# Altium project 4-Port_USB_HUB_Project.PrjPcb
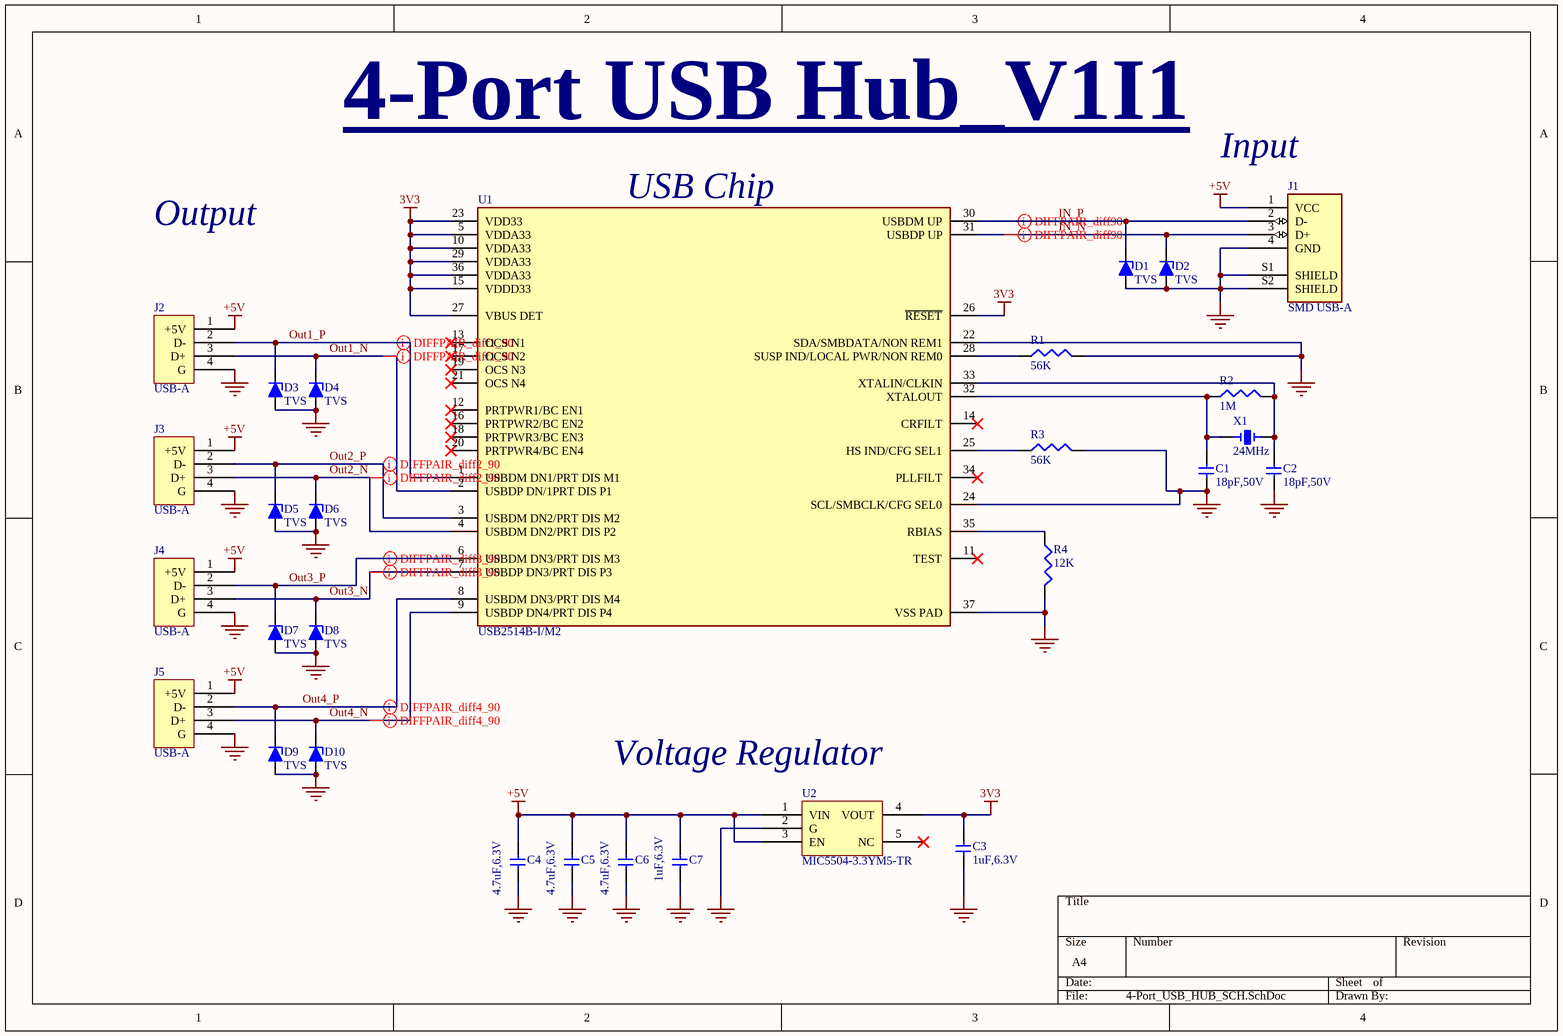
[diagram p0: 4-Port_USB_HUB_SCH.SchDoc]
CompanyName: Altium Training
1 sheet, 29 parts. Net scope: global (net labels, ports and power ports of the same name join across sheets).
Board file: 4-Port_USB_HUB_PCB.PcbDoc

## Sheet 4-Port_USB_HUB_SCH.SchDoc
size A4

### Parts
C1  18pF,50V  [18pF]
C2  18pF,50V  [18pF]
C3  1uF,6.3V  [1uF_CAP]
C4  4.7uF,6.3V  [4.7uF_CAP]
C5  4.7uF,6.3V  [4.7uF_CAP]
C6  4.7uF,6.3V  [4.7uF_CAP]
C7  1uF,6.3V  [1uF_CAP]
D1  TVS  [ESD Diode]
D2  TVS  [ESD Diode]
D3  TVS  [ESD Diode]
D4  TVS  [ESD Diode]
D5  TVS  [ESD Diode]
D6  TVS  [ESD Diode]
D7  TVS  [ESD Diode]
D8  TVS  [ESD Diode]
D9  TVS  [ESD Diode]
D10  TVS  [ESD Diode]
J1  SMD USB-A  [SMD USB-A]
J2  USB-A  [USB_Connector]
J3  USB-A  [USB_Connector]
J4  USB-A  [USB_Connector]
J5  USB-A  [USB_Connector]
R1  56K  [56K]
R2  1M  [1M Res]
R3  56K  [56K]
R4  12K  [1M Res]
U1  USB2514B-I/M2  [IC_microchip]
U2  MIC5504-3.3YM5-TR  [Voltage Regulator]
X1  24MHz  [Crystal]

### Nets
3V3: C3.1 U1.5(VDDA33) U1.10(VDDA33) U1.15(VDDD33) U1.23(VDD33) U1.26(~{RESET}) U1.27(VBUS_DET) U1.29(VDDA33) U1.36(VDDA33) U2.4(VOUT)
+5V: C4.1 C5.1 C6.1 C7.1 J1.1(VCC) J2.1(+5V) J3.1(+5V) J4.1(+5V) J5.1(+5V) U2.1(VIN) U2.3(EN)
GND: C1.2 C2.2 C3.2 C4.2 C5.2 C6.2 C7.2 D1.1 D2.1 D3.1 D4.1 D5.1 D6.1 D7.1 D8.1 D9.1 D10.1 J1.4(GND) J1.S1(SHIELD) J1.S2(SHIELD) J2.4(G) J3.4(G) J4.4(G) J5.4(G) R1.2 R3.2 R4.2 U1.22(SDA/SMBDATA/NON_REM1) U1.24(SCL/SMBCLK/CFG_SEL0) U1.37(VSS_PAD) U2.2(G)
IN_N: D2.2 J1.3(D+) U1.31(USBDP_UP)
IN_P: D1.2 J1.2(D-) U1.30(USBDM_UP)
Out1_N: D4.2 J2.3(D+) U1.2(USBDP_DN/1PRT_DIS_P1)
Out1_P: D3.2 J2.2(D-) U1.1(USBDM_DN1/PRT_DIS_M1)
Out2_N: D6.2 J3.3(D+) U1.4(USBDM_DN2/PRT_DIS_P2)
Out2_P: D5.2 J3.2(D-) U1.3(USBDM_DN2/PRT_DIS_M2)
Out3_N: D8.2 J4.3(D+) U1.7(USBDP_DN3/PRT_DIS_P3)
Out3_P: D7.2 J4.2(D-) U1.6(USBDM_DN3/PRT_DIS_M3)
Out4_N: D10.2 J5.3(D+) U1.9(USBDP_DN4/PRT_DIS_P4)
Out4_P: D9.2 J5.2(D-) U1.8(USBDM_DN3/PRT_DIS_M4)
NetC1_1: C1.1 R2.1 U1.32(XTALOUT) X1.1
NetC2_1: C2.1 R2.2 U1.33(XTALIN/CLKIN) X1.3
NetR1_1: R1.1 U1.28(SUSP_IND/LOCAL_PWR/NON_REM0)
NetR3_1: R3.1 U1.25(HS_IND/CFG_SEL1)
NetR4_1: R4.1 U1.35(RBIAS)

Not connected (* = marked no-connect by the designer): U1 11(TEST)* 12(PRTPWR1/BC_EN1)* 13(OCS_N1)* 14(CRFILT)* 16(PRTPWR2/BC_EN2)* 17(OCS_N2)* 18(PRTPWR3/BC_EN3)* 19(OCS_N3)* 20(PRTPWR4/BC_EN4)* 21(OCS_N4)* 34(PLLFILT)*; U2 5(NC)*

### Layout directives
differential pair; differential pair class diff90: IN_N, IN_P
differential pair; differential pair class diff1_90: Out1_N, Out1_P
differential pair; differential pair class diff2_90: Out2_N, Out2_P
differential pair; differential pair class diff3_90: Out3_N, Out3_P
differential pair; differential pair class diff4_90: Out4_N, Out4_P

### Notes on the sheet
- 4-Port USB Hub_V1I1
- (near J1) Input
- Output
- (near U1) USB Chip
- (near U2) Voltage Regulator

### Library data of the parts
C1 C2 = C0805C180J5GACTU: 18PF 50V 0805; Manufacturer: KEMET; Dielectric Material: Ceramic; Tolerance: 5%; Dielectric: C0G; Temperature Coefficient: 30ppm/°C; Dissipation Factor: 0.1%; Supplier 1: Digi-Key; Manufacturer Part Number: C0805C180J5GACTU; RoHS: Yes; Category: Ceramic Capacitors; Stock 1: 4285; Pricing 1: 1=0.13000, 10=0.09000, 50=0.05140, 100=0.04250, 500=0.02982, 1000=0.02468 (USD); Mount: Surface Mount,PCB; Case/Package: 0805; Number of Pins: 2; Contact Plating: Tin,Matte; Contact Material: Tin; Case Code (Imperial): 0805; Case Code (Metric): 2012; Min Operating Temperature: -55°C; Max Operating Temperature: 125°C; Capacitance: 18pF; Packaging: Tape and Reel; Voltage: 50V; Termination: SMD/SMT; Voltage Rating (DC): 50V; Package Quantity: 1; Voltage Rating: 50V; Series: C; Construction: Flat; Length: 2mm; Width: 1.2mm; Height: 0.78mm; Depth: 1.25mm; Lead Pitch: 0.75mm; Thickness: 0.035inch; Radiation Hardening: No; Lead Free: Lead Free; REACH SVHC: No SVHC; RoHS Compliant: Yes; ComponentLink1URL: https://datasheet.ciiva.com/22746/1769375-22746770.pdf?src-supplier=Element14; ComponentLink1Description: https://datasheet.ciiva.com/22746/1769375-22746770.pdf?src-supplier=Element14; ComponentLink2URL: https://datasheet.ciiva.com/26923/getdatasheetpartid-759702-26923980.pdf?src-supplier=Verical; ComponentLink2Description: https://datasheet.ciiva.com/26923/getdatasheetpartid-759702-26923980.pdf?src-supplier=Verical; ComponentLink3URL: https://datasheet.ciiva.com/26847/getdatasheetpartid-385668-26847862.pdf?src-supplier=Verical; ComponentLink3Description: https://datasheet.ciiva.com/26847/getdatasheetpartid-385668-26847862.pdf?src-supplier=Verical; Supplier Part Number 1: 399-1112-1-ND
C3 C7 = C0402C105K9PACTU: 1uF 6.3V 0402; Manufacturer: KEMET; Dielectric Material: Ceramic; Tolerance: 10%; Dielectric: X5R; Supplier 1: Digi-Key; Manufacturer Part Number: C0402C105K9PACTU; RoHS: Yes; Category: Ceramic Capacitors; Stock 1: 252140; Pricing 1: 1=0.10000, 10=0.02400, 50=0.01320, 100=0.01070, 500=0.00764, 1000=0.00601, 2500=0.00546, 5000=0.00503 (USD); Mount: Surface Mount; Case/Package: 0402; Number of Pins: 2; Case Code (Imperial): 0402; Min Operating Temperature: -55°C; Max Operating Temperature: 85°C; Capacitance: 1uF; Packaging: Tape and Reel; Voltage Rating: 6.3V; Voltage: 6.3V; Termination: SMD/SMT; Voltage Rating (DC): 6.3V; Package Quantity: 1; Series: C; Construction: Flat; Length: 1mm; Width: 0.02inch; Height: 0.5mm; Thickness: 0.022inch; Depth: 0.5mm; Lead Pitch: 0.3mm; Radiation Hardening: No; Lead Free: Lead Free; REACH SVHC: No SVHC; RoHS Compliant: Yes; ComponentLink1URL: https://datasheet.ciiva.com/28645/1789732-28645392.pdf?src-supplier=Element14; ComponentLink1Description: https://datasheet.ciiva.com/28645/1789732-28645392.pdf?src-supplier=Element14; ComponentLink2URL: https://datasheet.ciiva.com/7747/kem-c1006-x5r-smd-7747445.pdf?src-supplier=Element14; ComponentLink2Description: https://datasheet.ciiva.com/7747/kem-c1006-x5r-smd-7747445.pdf?src-supplier=Element14; ComponentLink3URL: https://datasheet.ciiva.com/7747/40889-7747623.pdf?src-supplier=Element14; ComponentLink3Description: https://datasheet.ciiva.com/7747/40889-7747623.pdf?src-supplier=Element14; ComponentLink4URL: https://datasheet.ciiva.com/18192/getdatasheetpartid-127800-18192427.pdf?src-supplier=Verical; ComponentLink4Description: https://datasheet.ciiva.com/18192/getdatasheetpartid-127800-18192427.pdf?src-supplier=Verical; Supplier Part Number 1: 399-4873-1-ND
C4-C6 = GRM155R60J475ME47D: 4.7uF 6.3V 0402; Manufacturer: Murata; Tolerance: 20%; Dielectric: X5R; Supplier 1: RSComponents; Manufacturer Part Number: GRM155R60J475ME47D; RoHS: Yes; Category: Ceramic Capacitors; Stock 1: 42550; Pricing 1: 50=0.07500, 500=0.02600, 2500=0.02500, 5000=0.02500, 10000=0.02300 (USD); Mount: Surface Mount; Case/Package: 0402; Case Code (Metric): 1005; Case Code (Imperial): 0402; Weight: 0.000212oz; Contact Plating: Tin; Min Operating Temperature: -55°C; Max Operating Temperature: 85°C; Package Quantity: 10000; Capacitance: 4.7uF; Voltage Rating: 6.3V; Packaging: Cut Tape; Termination: Standard; Voltage: 6.3V; Voltage Rating (DC): 6.3V; Series: GRM; Length: 1mm; Width: 0.5mm; Height: 0.5mm; Thickness: 0.022inch; Depth: 0.5mm; REACH SVHC: No SVHC; Lead Free: Lead Free; RoHS Compliant: Yes; ComponentLink1URL: https://datasheet.ciiva.com/6270/product-6270483.pdf?src-supplier=Digi-Key; ComponentLink1Description: https://datasheet.ciiva.com/6270/product-6270483.pdf?src-supplier=Digi-Key; ComponentLink2URL: https://datasheet.ciiva.com/6268/partnumbering-e-01-6268378.pdf?src-supplier=Digi-Key; ComponentLink2Description: https://datasheet.ciiva.com/6268/partnumbering-e-01-6268378.pdf?src-supplier=Digi-Key; ComponentLink3URL: https://datasheet.ciiva.com/46418/1769893-46418044.pdf?src-supplier=Element14; ComponentLink3Description: https://datasheet.ciiva.com/46418/1769893-46418044.pdf?src-supplier=Element14; ComponentLink4URL: https://datasheet.ciiva.com/46418/1769893-46418045.pdf?src-supplier=Element14; ComponentLink4Description: https://datasheet.ciiva.com/46418/1769893-46418045.pdf?src-supplier=Element14; ComponentLink5URL: https://datasheet.ciiva.com/6268/partnumbering-e-01-6268382.pdf?src-supplier=Digi-Key; ComponentLink5Description: https://datasheet.ciiva.com/6268/partnumbering-e-01-6268382.pdf?src-supplier=Digi-Key; Supplier Part Number 1: 8145230P
D1-D10 = ESD9B3.3ST5G: TVS Diode; Manufacturer: ON Semiconductor; Number of Bidirectional Channels: 1; Reverse Standoff Voltage: 3.3V; Min Breakdown Voltage: 5V; Clamping Voltage: 10.5V; Power Line Protection: No; Peak Pulse Current: 2A; Capacitance: 15pF; Direction: Bidirectional; Leakage Current: 1uA; Peak Pulse Power: 300mW; ESD Protection: Yes; Test Current: 1mA; Element Configuration: Single; Diode Type: ZENER; Supplier 1: Digi-Key; Manufacturer Part Number: ESD9B3.3ST5G; RoHS: Yes; Category: ESD and Circuit Protection ICs; Stock 1: 6111; Pricing 1: 1=0.23000, 10=0.18500, 100=0.09790, 500=0.06440, 1000=0.04379, 2000=0.03950 (USD); Case/Package: SOD-923-2; Number of Pins: 2; Contact Plating: Tin,Matte; Min Operating Temperature: -55°C; Max Operating Temperature: 150°C; Packaging: Tape and Reel; Resistor Type: Zener; Package Quantity: 1; Number of Elements: 1; Operating Supply Voltage: 3.3V; Reverse Breakdown Voltage: 5V; Breakdown Voltage: 5V; Number of Channels: 1; Polarity: Bidirectional; Termination: SMD/SMT; Working Voltage: 3.3V; Max Reverse Leakage Current: 1uA; Max Power Dissipation: 300mW; Number of Lines: 1; Series: Automotive, AEC-Q101; Length: 0.8mm; Width: 0.65mm; Height: 0.4mm; Depth: 0.6mm; Radiation Hardening: No; Lead Free: Lead Free; RoHS Compliant: Yes; REACH SVHC: No SVHC; Halogen Free: Halogen Free; ComponentLink1URL: https://datasheet.ciiva.com/339/esd9b-d-339712.pdf?src-supplier=Digi-Key; ComponentLink1Description: https://datasheet.ciiva.com/339/esd9b-d-339712.pdf?src-supplier=Digi-Key; ComponentLink2URL: https://datasheet.ciiva.com/339/esd9b-d-339712.pdf?src-supplier=Mouser; ComponentLink2Description: https://datasheet.ciiva.com/339/esd9b-d-339712.pdf?src-supplier=Mouser; ComponentLink3URL: https://datasheet.ciiva.com/25958/esd9b-d-25958117.pdf?src-supplier=Avnet+Europe; ComponentLink3Description: https://datasheet.ciiva.com/25958/esd9b-d-25958117.pdf?src-supplier=Avnet+Europe; ComponentLink4URL: https://datasheet.ciiva.com/339/esd9b-d-339713.pdf?src-supplier=Digi-Key; ComponentLink4Description: https://datasheet.ciiva.com/339/esd9b-d-339713.pdf?src-supplier=Digi-Key; ComponentLink5URL: https://datasheet.ciiva.com/339/esd9b-d-339714.pdf?src-supplier=Digi-Key; ComponentLink5Description: https://datasheet.ciiva.com/339/esd9b-d-339714.pdf?src-supplier=Digi-Key; ComponentLink6URL: https://datasheet.ciiva.com/22642/1596367-22642026.pdf?src-supplier=Element14; ComponentLink6Description: https://datasheet.ciiva.com/22642/1596367-22642026.pdf?src-supplier=Element14; ComponentLink7URL: https://datasheet.ciiva.com/26917/getdatasheetpartid-292713-26917946.pdf?src-supplier=Verical; ComponentLink7Description: https://datasheet.ciiva.com/26917/getdatasheetpartid-292713-26917946.pdf?src-supplier=Verical; ComponentLink8URL: https://datasheet.ciiva.com/22642/1596367-22642028.pdf?src-supplier=Element14; ComponentLink8Description: https://datasheet.ciiva.com/22642/1596367-22642028.pdf?src-supplier=Element14; ComponentLink9URL: https://datasheet.ciiva.com/11193/esd9b-d-11193999.pdf?src-supplier=Avnet; ComponentLink9Description: https://datasheet.ciiva.com/11193/esd9b-d-11193999.pdf?src-supplier=Avnet; Supplier Part Number 1: ESD9B3.3ST5GOSCT-ND
J1 = USB-A-S-S-B-SM2: USB - A USB 2.0 Receptacle Connector 4 Position Surface Mount, Right Angle, Horizontal; Manufacturer: Samtec; Number of Terminals/Pins: 4; Number of Ports: 1; Max Voltage Rating (AC): 30V; Supplier 1: Digi-Key; Manufacturer Part Number: USB-A-S-S-B-SM2; RoHS: Yes; Category: Connectors; Stock 1: 1137; Pricing 1: 1=2.03000, 10=1.84300, 25=1.73040, 40=1.65525, 80=1.58000, 230=1.42952, 440=1.31668, 945=1.12858, 2400=1.05335 (USD); Mount: Surface Mount,Horizontal; Contact Material: Bronze; Contact Plating: Gold; Housing Material: Thermoplastic; Min Operating Temperature: -50°C; Max Operating Temperature: 85°C; Packaging: Tray; Package Quantity: 1; Connector Type: USB; Number of Contacts: 4; Gender: Receptacle; Termination: Solder; Orientation: Right Angle; Series: USB-A; Length: 16.4mm; Depth: 14.8mm; Radiation Hardening: No; RoHS Compliant: Yes; ComponentLink1URL: https://datasheet.ciiva.com/851/usb-a-851788.pdf?src-supplier=Digi-Key; ComponentLink1Description: https://datasheet.ciiva.com/851/usb-a-851788.pdf?src-supplier=Digi-Key; Supplier Part Number 1: SAM10864-ND
J2-J5 = KUSBVX-AS1N-B30: Conn USB SKT 4 POS Solder ST Thru-Hole 4 Terminal 1 Port; Manufacturer: Kycon; Current Rating: 1A; Gender: Female; Connector Type: USB,Receptacle; Number of Contacts: 4; Insulation Resistance: 1GR; Number of Ports: 1; Supplier 1: Digi-Key; Manufacturer Part Number: KUSBVX-AS1N-B30; RoHS: Yes; Category: USB Connectors; Stock 1: 953; Pricing 1: 1=1.23000, 10=1.08400, 25=1.02040, 40=0.97800, 80=0.93550, 230=0.85043, 440=0.76539, 945=0.68034, 2400=0.61655 (USD); Mount: Through Hole; Color: Black; Contact Material: Bronze; Contact Plating: Gold; Housing Material: Thermoplastic; Insulation Color: Black; Termination: Solder; Orientation: Straight; Packaging: Tray; Number of Positions: 4; Package Quantity: 120; Series: KUSBVX; Radiation Hardening: No; Flammability Rating: UL94 V-0; RoHS Compliant: Yes; ComponentLink1URL: https://datasheet.ciiva.com/16668/kusbvx-as1n-xxx-16668448.pdf?src-supplier=Avnet+Europe; ComponentLink1Description: https://datasheet.ciiva.com/16668/kusbvx-as1n-xxx-16668448.pdf?src-supplier=Avnet+Europe; ComponentLink2URL: https://datasheet.ciiva.com/4599/kusbvx-334767-4599050.pdf?src-supplier=Mouser; ComponentLink2Description: https://datasheet.ciiva.com/4599/kusbvx-334767-4599050.pdf?src-supplier=Mouser; ComponentLink3URL: https://datasheet.ciiva.com/3095/kusbvx-as1n-xxx-3095637.pdf?src-supplier=Avnet; ComponentLink3Description: https://datasheet.ciiva.com/3095/kusbvx-as1n-xxx-3095637.pdf?src-supplier=Avnet; Supplier Part Number 1: 2092-KUSBVX-AS1N-B30-ND
R1 R3 = RC0402JR-0756KL: Manufacturer: Yageo; Resistance: 56kR; Tolerance: 5%; Temperature Coefficient: 100ppm/°C; Power Rating: 63mW; Voltage Rating: 50V; Supplier 1: Digi-Key; Manufacturer Part Number: RC0402JR-0756KL; RoHS: Yes; Category: Chip SMD Resistors; Stock 1: 173524; Pricing 1: 1=0.10000, 10=0.01300, 100=0.00540, 1000=0.00244, 2500=0.00212, 5000=0.00175 (USD); Case/Package: 0402; Contact Plating: Tin,Matte; Case Code (Imperial): 0402; Case Code (Metric): 1005; Weight: 2.3E-05oz; Min Operating Temperature: -55°C; Max Operating Temperature: 155°C; Resistor Type: Thick Film; Packaging: Tape and Reel; Termination: SMD/SMT; Working Voltage: 50V; Number of Terminations: 2; Features: Moisture Resistant; Series: RC; Max Power Dissipation: 63mW; Construction: Rectangular; Resistance Tolerance: 5%; Technology: THICK FILM; Length: 1mm; Width: 0.5mm; Height: 0.35mm; Depth: 0.5mm; Radiation Hardening: No; REACH SVHC: Unknown; Military Standard: Not; Lead Free: Lead Free; RoHS Compliant: Yes; ComponentLink1URL: https://datasheet.ciiva.com/7850/1018594-7850229.pdf?src-supplier=Element14; ComponentLink1Description: https://datasheet.ciiva.com/7850/1018594-7850229.pdf?src-supplier=Element14; ComponentLink2URL: https://datasheet.ciiva.com/12577/pyu-rc0402-51-rohs-l-6-r-12577526.pdf?src-supplier=Mouser; ComponentLink2Description: https://datasheet.ciiva.com/12577/pyu-rc0402-51-rohs-l-6-r-12577526.pdf?src-supplier=Mouser; ComponentLink3URL: https://datasheet.ciiva.com/15189/getdatasheetpartid-251833-15189574.pdf?src-supplier=Verical; ComponentLink3Description: https://datasheet.ciiva.com/15189/getdatasheetpartid-251833-15189574.pdf?src-supplier=Verical; ComponentLink4URL: https://datasheet.ciiva.com/16742/pyu-rc0402-51-rohs-l-6-r-16742167.pdf?src-supplier=Future+Electronics; ComponentLink4Description: https://datasheet.ciiva.com/16742/pyu-rc0402-51-rohs-l-6-r-16742167.pdf?src-supplier=Future+Electronics; ComponentLink5URL: https://datasheet.ciiva.com/7983/1018594-7983592.pdf?src-supplier=Element14; ComponentLink5Description: https://datasheet.ciiva.com/7983/1018594-7983592.pdf?src-supplier=Element14; ComponentLink6URL: https://datasheet.ciiva.com/16862/pyu-rc0402-51-rohs-l-6-16862495.pdf?src-supplier=Avnet+Europe; ComponentLink6Description: https://datasheet.ciiva.com/16862/pyu-rc0402-51-rohs-l-6-16862495.pdf?src-supplier=Avnet+Europe; Supplier Part Number 1: 311-56KJRCT-ND
R2 = RC0402FR-071ML: 1M OHM; Manufacturer: Yageo; Resistance: 1MR; Tolerance: 1%; Power Rating: 63mW; Voltage Rating: 50V; Temperature Coefficient: 100ppm/°C; Supplier 1: Digi-Key; Manufacturer Part Number: RC0402FR-071ML; RoHS: Yes; Category: Chip SMD Resistors; Stock 1: 3696366; Pricing 1: 1=0.10000, 10=0.01600, 100=0.00660, 1000=0.00299, 2500=0.00259, 5000=0.00214 (USD); Case/Package: 0402; Case Code (Imperial): 0402; Case Code (Metric): 1005; Size Code: 0402; Min Operating Temperature: -55°C; Max Operating Temperature: 155°C; Resistor Type: Thick Film; Packaging: Tape and Reel; Termination: SMD/SMT; Features: Moisture Resistant; Series: RC; Max Power Dissipation: 63mW; Number of Terminations: 2; Resistance Tolerance: 1%; Construction: Rectangular; Technology: THICK FILM; Length: 1mm; Height: 0.32mm; Depth: 0.5mm; RoHS Compliant: Yes; REACH SVHC: Unknown; Military Standard: Not; Lead Free: Lead Free; ComponentLink1URL: https://datasheet.ciiva.com/11808/0900766b80c66297-11808125.pdf?src-supplier=RSComponents; ComponentLink1Description: https://datasheet.ciiva.com/11808/0900766b80c66297-11808125.pdf?src-supplier=RSComponents; ComponentLink2URL: https://datasheet.ciiva.com/46394/1018594-46394951.pdf?src-supplier=Element14; ComponentLink2Description: https://datasheet.ciiva.com/46394/1018594-46394951.pdf?src-supplier=Element14; ComponentLink3URL: https://datasheet.ciiva.com/16741/pyu-rc0402-51-rohs-l-6-r-16741081.pdf?src-supplier=Future+Electronics; ComponentLink3Description: https://datasheet.ciiva.com/16741/pyu-rc0402-51-rohs-l-6-r-16741081.pdf?src-supplier=Future+Electronics; ComponentLink4URL: https://datasheet.ciiva.com/7849/1018594-7849882.pdf?src-supplier=Element14; ComponentLink4Description: https://datasheet.ciiva.com/7849/1018594-7849882.pdf?src-supplier=Element14; ComponentLink5URL: https://datasheet.ciiva.com/7849/1018594-7849883.pdf?src-supplier=Element14; ComponentLink5Description: https://datasheet.ciiva.com/7849/1018594-7849883.pdf?src-supplier=Element14; Supplier Part Number 1: 311-1.00MLRCT-ND
R4 = RC0402JR-0712KL: 12K OHM; Manufacturer: Yageo; Power Rating: 63mW; Tolerance: 5%; Voltage Rating: 50V; Resistance: 12kR; Temperature Coefficient: 100ppm/°C; Supplier 1: Digi-Key; Manufacturer Part Number: RC0402JR-0712KL; RoHS: Yes; Category: Chip SMD Resistors; Stock 1: 42769; Pricing 1: 1=0.10000, 10=0.01300, 100=0.00540, 1000=0.00244, 2500=0.00212, 5000=0.00175 (USD); Case/Package: 0402; Number of Pins: 2; Case Code (Metric): 1005; Case Code (Imperial): 0402; Size Code: 0402; Min Operating Temperature: -55°C; Max Operating Temperature: 155°C; Voltage Rating (DC): 50V; Packaging: Tape and Reel; Package Quantity: 1; Resistor Type: Thick Film; Number of Terminations: 2; Termination: SMD/SMT; Max Power Dissipation: 63mW; Features: Moisture Resistant; Series: RC; Resistance Tolerance: 5%; Construction: Rectangular; Length: 1mm; Width: 0.02inch; Height: 0.016inch; Depth: 0.5mm; REACH SVHC: No SVHC; Military Standard: Not; Lead Free: Lead Free; RoHS Compliant: Yes; ComponentLink1URL: https://datasheet.ciiva.com/2452/pyu-r-int-thick-7-2452758.pdf?src-supplier=Digi-Key; ComponentLink1Description: https://datasheet.ciiva.com/2452/pyu-r-int-thick-7-2452758.pdf?src-supplier=Digi-Key; ComponentLink2URL: https://datasheet.ciiva.com/6168/1018594-6168998.pdf?src-supplier=Farnell; ComponentLink2Description: https://datasheet.ciiva.com/6168/1018594-6168998.pdf?src-supplier=Farnell; ComponentLink3URL: https://datasheet.ciiva.com/2452/pyu-r-int-thick-7-2452759.pdf?src-supplier=Digi-Key; ComponentLink3Description: https://datasheet.ciiva.com/2452/pyu-r-int-thick-7-2452759.pdf?src-supplier=Digi-Key; ComponentLink4URL: https://datasheet.ciiva.com/2452/pyu-r-int-thick-7-2452760.pdf?src-supplier=Digi-Key; ComponentLink4Description: https://datasheet.ciiva.com/2452/pyu-r-int-thick-7-2452760.pdf?src-supplier=Digi-Key; ComponentLink5URL: https://datasheet.ciiva.com/7983/1018594-7983548.pdf?src-supplier=Element14; ComponentLink5Description: https://datasheet.ciiva.com/7983/1018594-7983548.pdf?src-supplier=Element14; ComponentLink6URL: https://datasheet.ciiva.com/5558/pyu-rc0402-51-rohs-l-6-r-5558094.pdf?src-supplier=Mouser; ComponentLink6Description: https://datasheet.ciiva.com/5558/pyu-rc0402-51-rohs-l-6-r-5558094.pdf?src-supplier=Mouser; Supplier Part Number 1: 311-12KJRCT-ND
U1 = USB2514B-I/M2: USB2514B-I/M2, USB Interface, USB Hub Controller, USB 2.0, 3 V, 3.6 V, SQFN, 36 Pins; Manufacturer: Microchip; Operating Supply Current: 70mA; Min Supply Voltage: 3V; Max Supply Voltage: 3.6V; Data Rate: 480Mbps; Number of Ports: 4; USB Standard: USB 2.0; Supplier 1: Newark; Manufacturer Part Number: USB2514B-I/M2; RoHS: Yes; Category: Integrated Circuits (ICs); Pricing 1: 1=3.55000, 10=3.29000, 25=3.02000 (USD); Number of Pins: 36; Min Operating Temperature: -40°C; Max Operating Temperature: 85°C; Packaging: Tray; Interface: USB; REACH SVHC: No SVHC; Lead Free: Lead Free; RoHS Compliant: Yes; ComponentLink1URL: http://www.farnell.com/datasheets/2032129.pdf?src-supplier=Farnell; ComponentLink1Description: http://www.farnell.com/datasheets/2032129.pdf?src-supplier=Farnell; ComponentLink2URL: http://www.farnell.com/datasheets/2032129.pdf?src-supplier=Element14; ComponentLink2Description: http://www.farnell.com/datasheets/2032129.pdf?src-supplier=Element14; ComponentLink3URL: http://www.microchip.com/mymicrochip/filehandler.aspx?ddocname=en562310&src-supplier=Digi-Key; ComponentLink3Description: http://www.microchip.com/mymicrochip/filehandler.aspx?ddocname=en562310&src-supplier=Digi-Key; Supplier Part Number 1: 55Y4214
U2 = MIC5504-3.3YM5-TR: MIC5504-3.3YM5-TR - LDO VOLT REG, 0.3A, 3.3V, SOT-23-5; Manufacturer: Microchip; Min Input Voltage: 2.5V; Max Input Voltage: 5.5V; Output Current: 300mA; Dropout Voltage: 380mV; Number of Outputs: 1; Quiescent Current: 38uA; Accuracy: 3%; Operating Supply Current: 42uA; Power Supply Rejection Ratio (PSRR): 60dB; Output Type: Fixed; Supplier 1: Digi-Key; Manufacturer Part Number: MIC5504-3.3YM5-TR; RoHS: Yes; Category: Voltage Regulators - Linear; Stock 1: 77294; Pricing 1: 1=0.13000, 25=0.09000, 100=0.08000 (USD); Mount: Surface Mount; Case/Package: SOT-23-5; Number of Pins: 5; Min Operating Temperature: -40°C; Max Operating Temperature: 125°C; Nominal Output Voltage: 3.3V; Packaging: Tape and Reel; Output Voltage: 3.3V; Max Output Current: 300mA; Length: 2.9mm; Width: 1.6mm; Height: 1.1mm; REACH SVHC: No SVHC; RoHS Compliant: No; ComponentLink1URL: https://datasheet.ciiva.com/46425/1856860-46425639.pdf?src-supplier=Element14; ComponentLink1Description: https://datasheet.ciiva.com/46425/1856860-46425639.pdf?src-supplier=Element14; Supplier Part Number 1: 576-4764-1-ND
X1 = XRCGB24M000F0L00R0: Manufacturer: Murata; Frequency Tolerance: 100ppm; Load Capacitance: 6pF; ESR (Equivalent Series Resistance): 150R; Frequency Stability: 50ppm; Supplier 1: Digi-Key; Manufacturer Part Number: XRCGB24M000F0L00R0; RoHS: Yes; Category: Crystals; Stock 1: 26986; Pricing 1: 1=0.32000, 10=0.26800, 50=0.24160, 100=0.21480, 500=0.20406, 1000=0.17184 (USD); Mount: Surface Mount; Case/Package: SMD/SMT; Number of Pins: 4; Min Operating Temperature: -30°C; Max Operating Temperature: 85°C; Frequency: 24MHz; Package Quantity: 3000; Packaging: Tape and Reel; Tolerance: 100ppm; Termination: SMD/SMT; Series Resistance: 150R; Series: XRCGB; Operating Frequency: 24 MHz; Length: 2mm; Width: 1.6mm; Height: 0.028inch; Depth: 1.6mm; REACH SVHC: No SVHC; Lead Free: Lead Free; RoHS Compliant: Yes; ComponentLink1URL: https://datasheet.ciiva.com/3852/part15-3852009.pdf?src-supplier=Arrow+Electronics; ComponentLink1Description: https://datasheet.ciiva.com/3852/part15-3852009.pdf?src-supplier=Arrow+Electronics; ComponentLink2URL: https://datasheet.ciiva.com/852/p79e-852274.pdf?src-supplier=Digi-Key; ComponentLink2Description: https://datasheet.ciiva.com/852/p79e-852274.pdf?src-supplier=Digi-Key; ComponentLink3URL: https://datasheet.ciiva.com/852/p79e-852275.pdf?src-supplier=Digi-Key; ComponentLink3Description: https://datasheet.ciiva.com/852/p79e-852275.pdf?src-supplier=Digi-Key; ComponentLink4URL: https://datasheet.ciiva.com/852/p79e-852276.pdf?src-supplier=Digi-Key; ComponentLink4Description: https://datasheet.ciiva.com/852/p79e-852276.pdf?src-supplier=Digi-Key; ComponentLink5URL: https://datasheet.ciiva.com/1361/l0445e-1361516.pdf?src-supplier=Element14; ComponentLink5Description: https://datasheet.ciiva.com/1361/l0445e-1361516.pdf?src-supplier=Element14; ComponentLink6URL: https://datasheet.ciiva.com/22695/1911263-22695436.pdf?src-supplier=Element14; ComponentLink6Description: https://datasheet.ciiva.com/22695/1911263-22695436.pdf?src-supplier=Element14; Supplier Part Number 1: 490-5575-1-ND